# Altium schematic sheet MAX17320.SchDoc
size A4; SheetNumber: 2; SheetTotal: 4
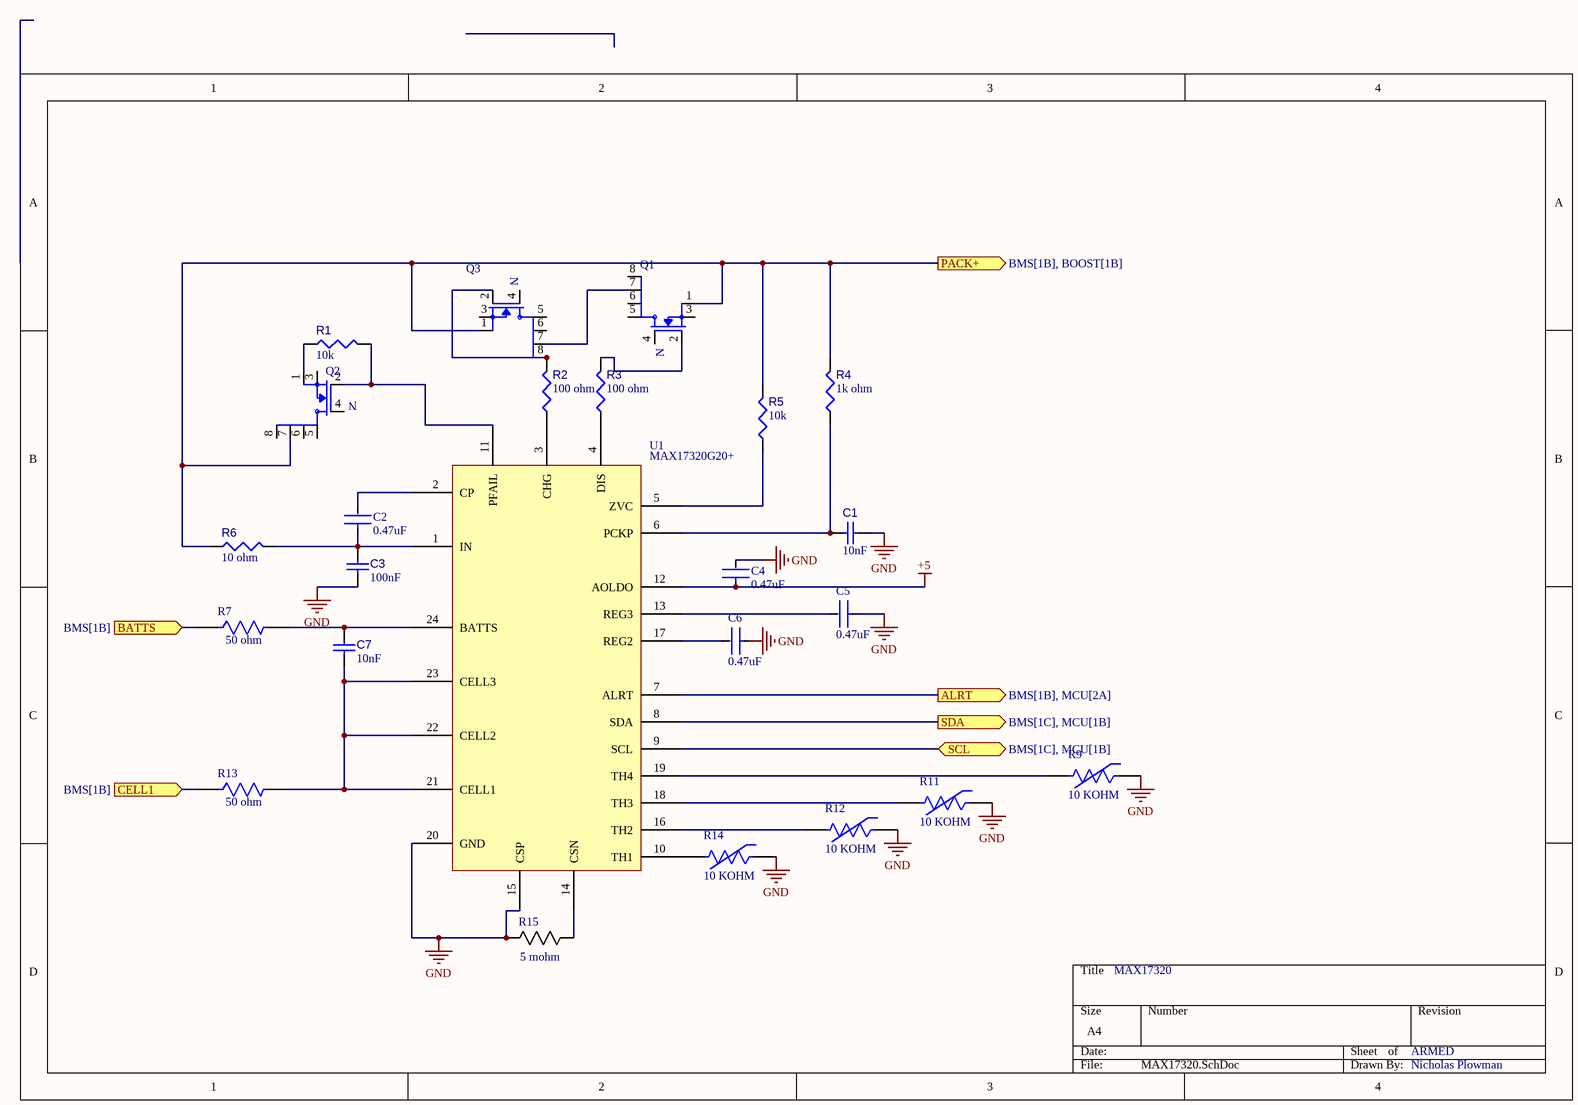
[diagram p0: MAX17320.SchDoc]

## Parts
C1  value 10nF  [CAPC0402(1005)60_L]  (hidden comment: Capacitor 10nF +/-20% 50V 0402)
C2  value 0.47uF  [FP-GRM15-0_1-MFG]  (hidden comment: GRM155R61A474KE15D)
C3  value 100nF  [CAPC1005X56X25LL10T15]  (hidden comment: Capacitor 0.1 uF +/- 5% 16 V 0402)
C4  value 0.47uF  [FP-GRM15-0_1-MFG]  (hidden comment: GRM155R61A474KE15D)
C5  value 0.47uF  [FP-GRM15-0_1-MFG]  (hidden comment: GRM155R61A474KE15D)
C6  value 0.47uF  [FP-GRM15-0_1-MFG]  (hidden comment: GRM155R61A474KE15D)
C7  value 10nF  [CAPC0402(1005)60_L]  (hidden comment: Capacitor 10nF +/-20% 50V 0402)
Q1  DN2625DK6-G-ND  [DN2625DK6-G-ND-Footprint-1]  (value not drawn)
Q2  DN2625DK6-G-ND  [DN2625DK6-G-ND-Footprint-1]  (value not drawn)
Q3  DN2625DK6-G-ND  [DN2625DK6-G-ND-Footprint-1]  (value not drawn)
R1  value 10k  [RESC1005X40X25ML05T05]  (hidden comment: Resistor 10k +/-1% 0402 100 mW)
R2  value 100 ohm  [RESC0402(1005)_L]  (hidden comment: 100R2F)
R3  value 100 ohm  [RESC0402(1005)_L]  (hidden comment: 100R2F)
R4  value 1k ohm  [RESC0402(1005)_L]  (hidden comment: 1KR2J)
R5  value 10k  [RESC1005X40X25ML05T05]  (hidden comment: Resistor 10k +/-1% 0402 100 mW)
R6  value 10 ohm  [RESC0402(1005)_L]  (hidden comment: 10R2F)
R7  value 50 ohm  [FP-CRCW0603-e3-IPC_A]  (hidden comment: CRCW060350R0FKEA)
R9  10 KOHM  [FP-NCP15-NCU15-0_05-MFG]
R11  10 KOHM  [FP-NCP15-NCU15-0_05-MFG]
R12  10 KOHM  [FP-NCP15-NCU15-0_05-MFG]
R13  value 50 ohm  [FP-CRCW0603-e3-IPC_A]  (hidden comment: CRCW060350R0FKEA)
R14  10 KOHM  [FP-NCP15-NCU15-0_05-MFG]
R15  Parameter 1: 5 mohm  [PA2512FKF7W0R005E-Footprint-1]  (hidden comment: PA2512FKF7W0R005E)
U1  MAX17320G20+  [MAX17320G12+-Footprint-1]

## Ports
ALRT (out, see BMS[1B], MCU[2A]), BATTS (in, see BMS[1B]), CELL1 (in, see BMS[1B]), PACK+ (out, see BMS[1B], BOOST[1B]), SCL (bidir, see BMS[1C], MCU[1B]), SDA (out, see BMS[1C], MCU[1B])

## Nets
+5: C4.1 U1.12(AOLDO)
GND: C1.1 C3.1 C4.2 C5.1 C6.1 R9.1 R11.1 R12.1 R14.1 R15.1 U1.15(CSP) U1.20(GND)
ALRT: U1.7(ALRT) ; port ALRT
BATTS: R7.1 ; port BATTS
CELL1: R13.1 ; port CELL1
PACK+: Q1.1(S1) Q2.7(D1_1) Q3.1(S1) R4.2 R5.2 R6.1 ; port PACK+
SCL: U1.9(SCL) ; port SCL
SDA: U1.8(SDA) ; port SDA
NetC1_2: C1.2 R4.1 U1.6(PCKP)
NetC2_1: C2.1 C3.2 R6.2 U1.1(IN)
NetC2_2: C2.2 U1.2(CP)
NetC5_2: C5.2 U1.13(REG3)
NetC6_2: C6.2 U1.17(REG2)
NetC7_1: C7.1 R13.2 U1.21(CELL1) U1.22(CELL2) U1.23(CELL3)
NetC7_2: C7.2 R7.2 U1.24(BATTS)
NetQ1_2: Q1.2(G1) R3.2
NetQ1_7: Q1.7(D1_1) Q3.7(D1_1)
NetQ2_1: Q2.1(S1) R1.1
NetQ2_2: Q2.2(G1) R1.2 U1.11(PFAIL)
NetQ3_2: Q3.2(G1) Q3.8(D1_2) R2.2
NetR2_1: R2.1 U1.3(CHG)
NetR3_1: R3.1 U1.4(DIS)
NetR5_1: R5.1 U1.5(ZVC)
NetR9_2: R9.2 U1.19(TH4)
NetR11_2: R11.2 U1.18(TH3)
NetR12_2: R12.2 U1.16(TH2)
NetR14_2: R14.2 U1.10(TH1)
NetR15_2: R15.2 U1.14(CSN)

Not connected (* = marked no-connect by the designer): Q1 3(S2) 4(G2) 5(D2_1) 6(D2_2) 8(D1_2); Q2 3(S2) 4(G2) 5(D2_1) 6(D2_2) 8(D1_2); Q3 3(S2) 4(G2) 5(D2_1) 6(D2_2)

## Notes on the sheet
- MAX17320
- ARMED
- Nicholas Plowman
- (in symbol CMP-013-00035-4) N

## Library data of the parts
C1 C7 = CMP-001-00069-3: Chip Capacitor, 10nF +/-20%, 50V, 0402, Thickness 0.6 mm; Tolerance: 5%; Max Operating Temperature: 85°C; Pins: 2; Case/Package: 0402; Voltage Rating: 50V; Min Operating Temperature: -55°C; Mounting Technology: SMT
C2 C4-C6 = CMP-001-00087-7: Multilayer Ceramic Capacitor, 0.47 uF, 10 V, ± 10%, X5R, 0402 [1005 Metric]
C3 = CMP-001-00001-6: Chip Capacitor, 0.1 uF, +/- 5%, 16 V, 0402 (1005 Metric); Capacitor Type: Ceramic; Voltage Rating: 16V; Max Operating Temperature: 125°C; Min Operating Temperature: -55°C; Case/Package: 0402; Mounting Technology: SM; Pins: 2; Tolerance: 5%; RoHS Compliant: True
Q1-Q3 = CMP-013-00035-4: MOSFET 2N-CH 250V 1.1A 8DFN
R1 R5 = CMP-009-00015-5: Chip Resistor, 10 KOhm, +/- 1%, 0.1 W, -55 to 155 degC, 0402 (1005 Metric); Voltage Rating: 50V; Power: 100mW; Case/Package: 0402; RoHS Compliant: True; Min Operating Temperature: -55°C; Mounting Technology: SM; Tolerance: 1%; Max Operating Temperature: 155°C; Pins: 2
R2 R3 = CMP-009-00065-2: 100R 0.063W 1% 0402 (1005 Metric)  SMD; Power: 63mW; Tolerance: 1%; Case/Package: 0402; Pins: 2; Mounting Technology: SMT
R4 = CMP-009-00075-2: 1K 0.063W 5% 0402 (1005 Metric)  SMD; Power: 63mW; Pins: 2; Mounting Technology: SMT; Case/Package: 0402; Tolerance: 5%
R6 = CMP-009-00067-2: 10R 0.063W 1% 0402 (1005 Metric)  SMD; Power: 63mW; Case/Package: 0402; Tolerance: 1%; Mounting Technology: SMT; Pins: 2
R7 R13 = CMP-009-00186-1: SMD Chip Resistor, 50 Ohm, ± 1%, 100 mW, 0603 [1608 Metric], Thick Film, General Purpose
R9 R11 R12 R14 = CMP-00013-1: Ntc Thermistor, Aec-Q200, 10Kohm, 0402 Rohs Compliant: Yes; Value: 10kR; Voltage Rating: 5V; Tolerance: 1%; Max Current Rating: 100uA; Max Operating Temperature: 125°C; Height: 550um; RoHS Compliant: Yes; Series: *; Min Operating Temperature: -40°C; Case/Package: 0402
R15 = CMP-009-00189-1: Res Thin Film 2512 5m Ohm 1% 2W ±100ppm/°C Molded SMD Embossed T/R
U1 = CMP-00012-2: Fuel Gauge 2S-4S ModelGauge m5 EZ with Protector I2C 4.2V to 18V 24-Pin TQFN